# EAGLE design vport (EAGLE 4.16)
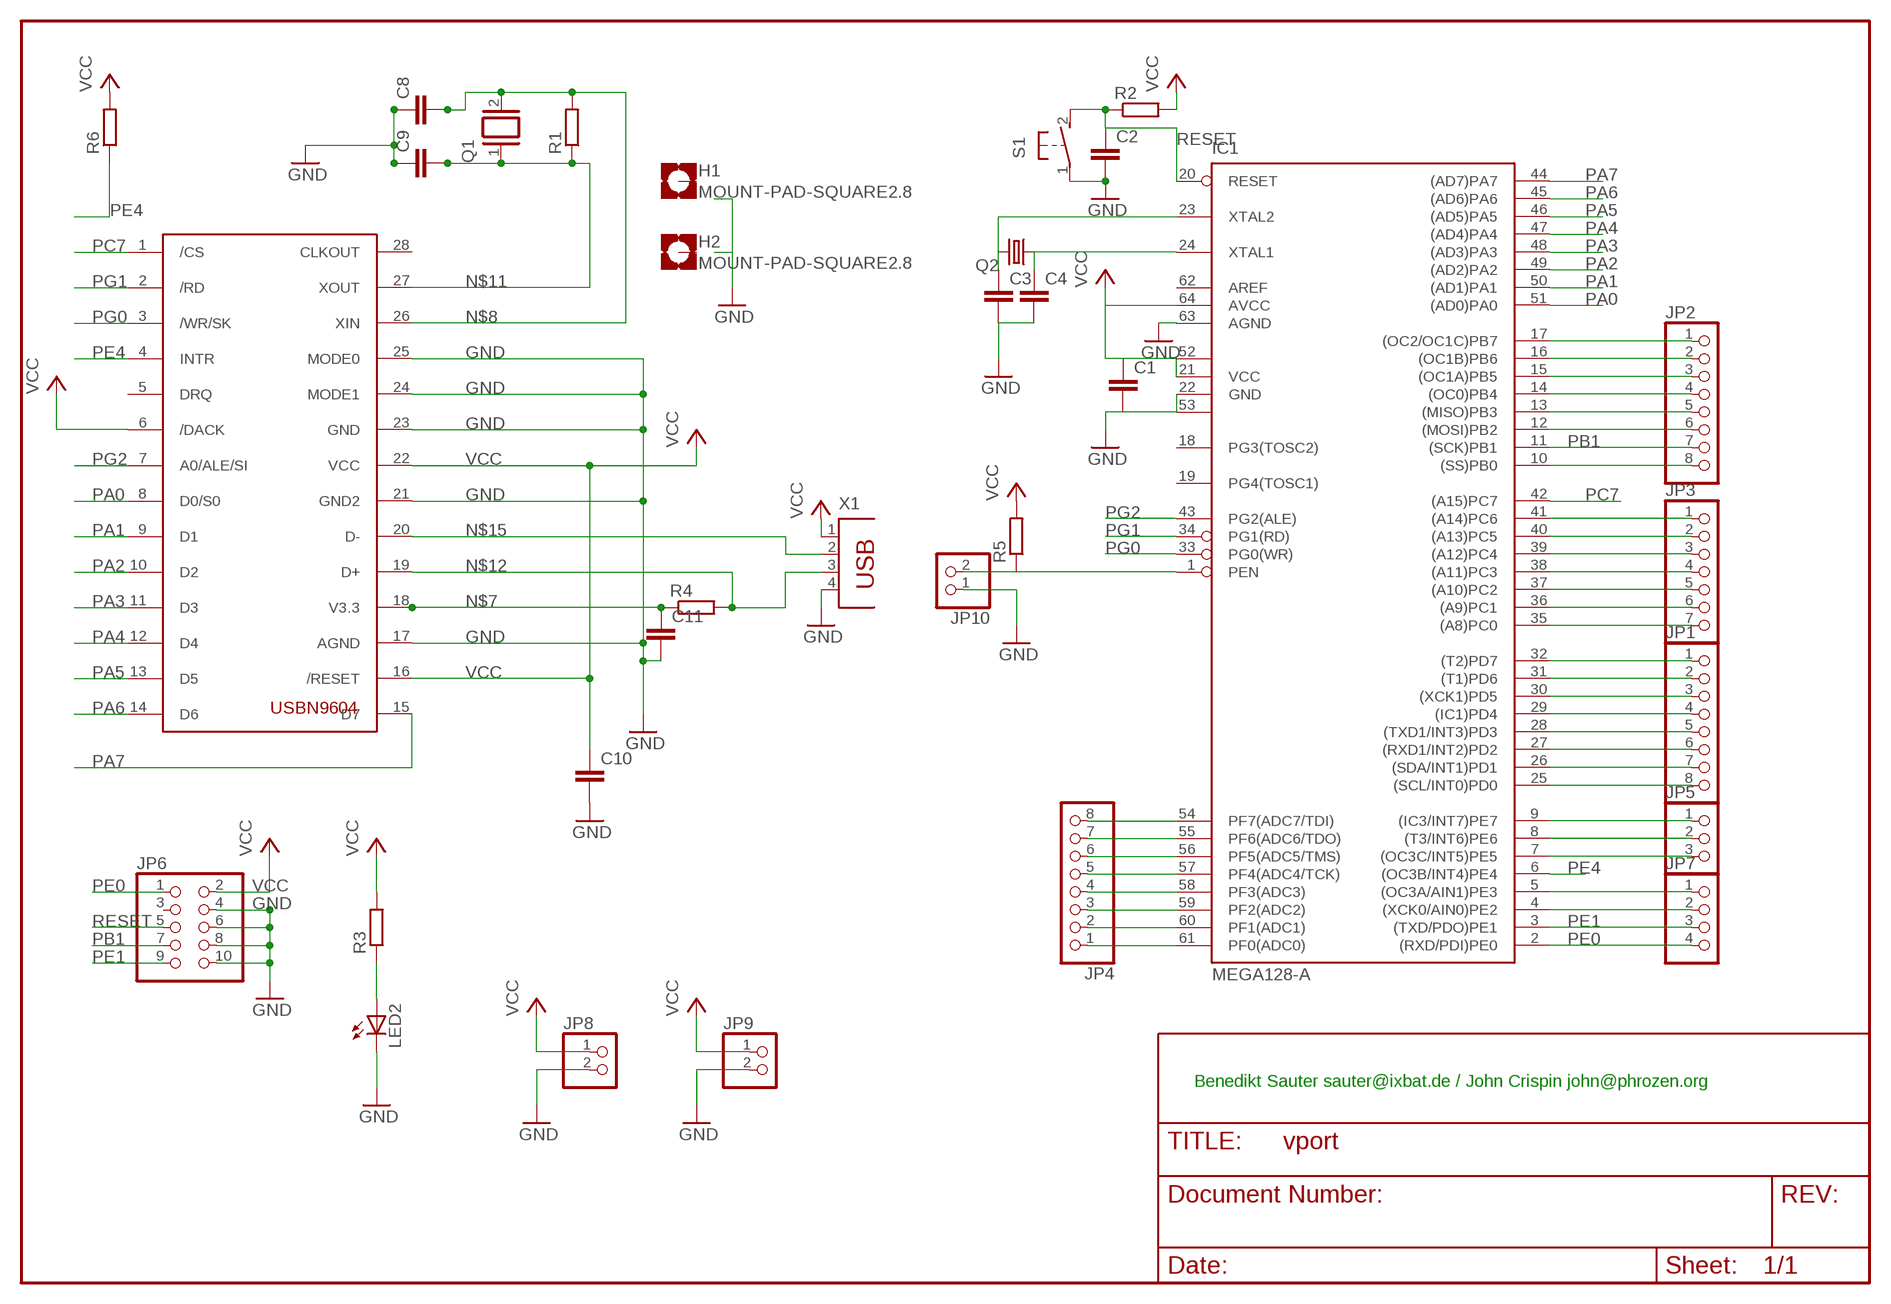
[diagram p0: schematic, sheet 1]

## Parts
C1  C-EUC0805K  [C0805K]
C2  C-EUC0805K  [C0805K]
C3  C-EUC0805K  [C0805K]
C4  C-EUC0805K  [C0805K]
C8  C-EUC0805K  [C0805K]
C9  C-EUC0805K  [C0805K]
C10  C-EUC0805K  [C0805K]
C11  C-EUC0805K  [C0805K]
H1  MOUNT-PAD-SQUARE2.8  [2,8-PAD-SQUARE]
H2  MOUNT-PAD-SQUARE2.8  [2,8-PAD-SQUARE]
IC1  MEGA128-A  [TQFP64]
JP1  PINHD-1X8  [1X08]
JP2  PINHD-1X8  [1X08]
JP3  PINHD-1X7  [1X07]
JP4  PINHD-1X8  [1X08]
JP5  PINHD-1X3  [1X03]
JP6  PINHD-2X5  [2X05]
JP7  PINHD-1X4  [1X04]
JP8  PINHD-1X2  [1X02]
JP9  PINHD-1X2  [1X02]
JP10  PINHD-1X2  [1X02]
LED2  LEDCHIP-LED0805  [CHIP-LED0805]
M1  USBN9604  [SO28-3]
Q1  XTAL/S  [QS]
Q2  CRYSTALHC49S  [HC49/S]
R1  R-EU_R0805  [R0805]
R2  R-EU_R0805  [R0805]
R3  R-EU_M0805  [M0805]
R4  R-EU_R0805  [R0805]
R5  R-EU_R0805  [R0805]
R6  R-EU_R0805  [R0805]
S1  31-XX  [B3F-31XX]
X1  PN61729  [PN61729]

## Nets
GND: C1.2 C2.2 C3.2 C4.2 C8.1 C9.1 C10.2 C11.2 IC1.22(GND) IC1.53(GND1) IC1.63(AGND) JP6.4 JP6.6 JP6.8 JP6.10 JP8.2 JP9.2 JP10.1 LED2.C M1.17(AGND) M1.21(GND2) M1.23(GND) M1.24(MODE1) M1.25(MODE0) S1.1(P) X1.4
N$1: IC1.17((OC2/OC1C)PB7) JP2.1
N$2: IC1.16((OC1B)PB6) JP2.2
N$3: IC1.15((OC1A)PB5) JP2.3
N$4: IC1.1(PEN) JP10.2 R5.1
N$5: C3.1 IC1.23(XTAL2) Q2.2
N$6: C4.1 IC1.24(XTAL1) Q2.1
N$7: C11.1 M1.18(V3.3) R4.1
N$8: C8.2 M1.26(XIN) Q1.2 R1.2
N$9: IC1.14((OC0)PB4) JP2.4
N$10: IC1.13((MISO)PB3) JP2.5
N$11: C9.2 M1.27(XOUT) Q1.1 R1.1
N$12: M1.19(D+) R4.2 X1.3
N$13: LED2.A R3.1
N$14: IC1.12((MOSI)PB2) JP2.6
N$15: M1.20(D-) X1.2
N$17: IC1.10((SS)PB0) JP2.8
N$18: IC1.32((T2)PD7) JP1.1
N$19: IC1.31((T1)PD6) JP1.2
N$20: IC1.30((XCK1)PD5) JP1.3
N$21: IC1.29((IC1)PD4) JP1.4
N$22: IC1.28((TXD1/INT3)PD3) JP1.5
N$23: IC1.27((RXD1/INT2)PD2) JP1.6
N$24: IC1.26((SDA/INT1)PD1) JP1.7
N$25: IC1.25((SCL/INT0)PD0) JP1.8
N$26: IC1.61(PF0(ADC0)) JP4.1
N$27: IC1.60(PF1(ADC1)) JP4.2
N$28: IC1.59(PF2(ADC2)) JP4.3
N$29: IC1.58(PF3(ADC3)) JP4.4
N$30: IC1.57(PF4(ADC4/TCK)) JP4.5
N$31: IC1.56(PF5(ADC5/TMS)) JP4.6
N$32: IC1.55(PF6(ADC6/TDO)) JP4.7
N$33: IC1.54(PF7(ADC7/TDI)) JP4.8
N$34: IC1.41((A14)PC6) JP3.1
N$35: IC1.40((A13)PC5) JP3.2
N$36: IC1.39((A12)PC4) JP3.3
N$37: IC1.38((A11)PC3) JP3.4
N$38: IC1.37((A10)PC2) JP3.5
N$39: IC1.36((A9)PC1) JP3.6
N$40: IC1.35((A8)PC0) JP3.7
N$41: IC1.9((IC3/INT7)PE7) JP5.1
N$42: IC1.8((T3/INT6)PE6) JP5.2
N$43: IC1.7((OC3C/INT5)PE5) JP5.3
N$44: IC1.5((OC3A/AIN1)PE3) JP7.1
N$45: IC1.4((XCK0/AIN0)PE2) JP7.2
PA0: IC1.51((AD0)PA0) M1.8(D0/S0)
PA1: IC1.50((AD1)PA1) M1.9(D1)
PA2: IC1.49((AD2)PA2) M1.10(D2)
PA3: IC1.48((AD3)PA3) M1.11(D3)
PA4: IC1.47((AD4)PA4) M1.12(D4)
PA5: IC1.46((AD5)PA5) M1.13(D5)
PA6: IC1.45((AD6)PA6) M1.14(D6)
PA7: IC1.44((AD7)PA7) M1.15(D7)
PB1: IC1.11((SCK)PB1) JP2.7 JP6.7
PC7: IC1.42((A15)PC7) M1.1(/CS)
PE0: IC1.2((RXD/PDI)PE0) JP6.1 JP7.4
PE1: IC1.3((TXD/PDO)PE1) JP6.9 JP7.3
PE4: IC1.6((OC3B/INT4)PE4) M1.4(INTR) R6.1
PG0: IC1.33(PG0(WR)) M1.3(/WR/SK)
PG1: IC1.34(PG1(RD)) M1.2(/RD)
PG2: IC1.43(PG2(ALE)) M1.7(A0/ALE/SI)
RESET: C2.1 IC1.20(RESET) JP6.5 R2.1 S1.2(S)
VCC: C1.1 C10.1 IC1.21(VCC) IC1.52(VCC1) IC1.64(AVCC) JP6.2 JP8.1 JP9.1 M1.6(/DACK) M1.16(/RESET) M1.22(VCC) R2.2 R3.2 R5.2 R6.2 X1.1
Unconnected: H1.B2,8(MOUNT) H2.B2,8(MOUNT) IC1.18(PG3(TOSC2)) IC1.19(PG4(TOSC1)) IC1.62(AREF) JP6.3 M1.5(DRQ) M1.28(CLKOUT)

## Notes on the sheet
- Benedikt Sauter sauter@ixbat.de / John Crispin john@phrozen.org

## Library data of the parts
C1-C4 C8-C11 = rcl:C-EU: CAPACITOR, European symbol
H1 H2 = holes:MOUNT-PAD-SQUARE: MOUNTING PAD, square
IC1 = atmel:MEGA128: MICROCONTROLLER 128 Kbytes FLASH 4 Kbytes SRAM 4 Kbytes EEPROM DUAL USART 8-channel 10 bit ADC Source: avr.lbr
JP1 JP2 JP4 = pinhead:PINHD-1X8: PIN HEADER
JP3 = pinhead:PINHD-1X7: PIN HEADER
JP5 = pinhead:PINHD-1X3: PIN HEADER
JP6 = pinhead:PINHD-2X5: PIN HEADER
JP7 = pinhead:PINHD-1X4: PIN HEADER
JP8-JP10 = pinhead:PINHD-1X2: PIN HEADER
LED2 = led:LED: LED OSRAM: - CHIPLED LG R971, LG N971, LY N971, LG Q971, LY Q971, LO R971, LY R971 LH N974, LH R974 LS Q976, LO Q976, LY Q976 LO Q996 - Hyper CHIPLED LW Q18S LB Q993, LB Q99A, LB R99A - SideLED LS A670, LO A670, LY A670, LG A670, LP A670 LB A673, LV A673, LT A673, LW A673 LH A674 LY A675 LS A676, LA A676, LO A676, LY A676, LW A676 LS A679, LY A679, LG A679 - Hyper Micro SIDELED® LS Y876, LA Y876, LO Y876, LY Y876 LT Y87S - SmartLED LW L88C, LW L88S LB L89C, LB L89S, LG L890 LS L89K, LO L89K, LY L89K LS L896, LA L896, LO L896, LY L896 - TOPLED LS T670, LO T670, LY T670, LG T670, LP T670 LSG T670, LSP T670, LSY T670, LOP T670, LYG T670 LG T671, LOG T671, LSG T671 LB T673, LV T673, LT T673, LW T673 LH T674 LS T676, LA T676, LO T676, LY T676, LB T676, LH T676, LSB T676, LW T676 LB T67C, LV T67C, LT T67C, LS T67K, LO T67K, LY T67K, LW E67C LS E67B, LA E67B, LO E67B, LY E67B, LB E67C, LV E67C, LT E67C LW T67C LS T679, LY T679, LG T679 LS T770, LO T770, LY T770, LG T770, LP T770 LB T773, LV T773, LT T773, LW T773 LH T774 LS E675, LA E675, LY E675, LS T675 LS T776, LA T776, LO T776, LY T776, LB T776 LHGB T686 LT T68C, LB T68C - Hyper Mini TOPLED® LB M676 - Mini TOPLED Santana® LG M470 LS M47K, LO M47K, LY M47K Source: http://www.osram.convergy.de/
M1 = bene:USBN9604
Q1 = special:XTAL/S: CRYSTAL
Q2 = crystal:CRYSTAL: CRYSTAL
R1-R6 = rcl:R-EU_: RESISTOR, European symbol
S1 = switch-omron:31-XX: OMRON SWITCH
X1 = con-berg:PN61729: BERG USB connector

## Board
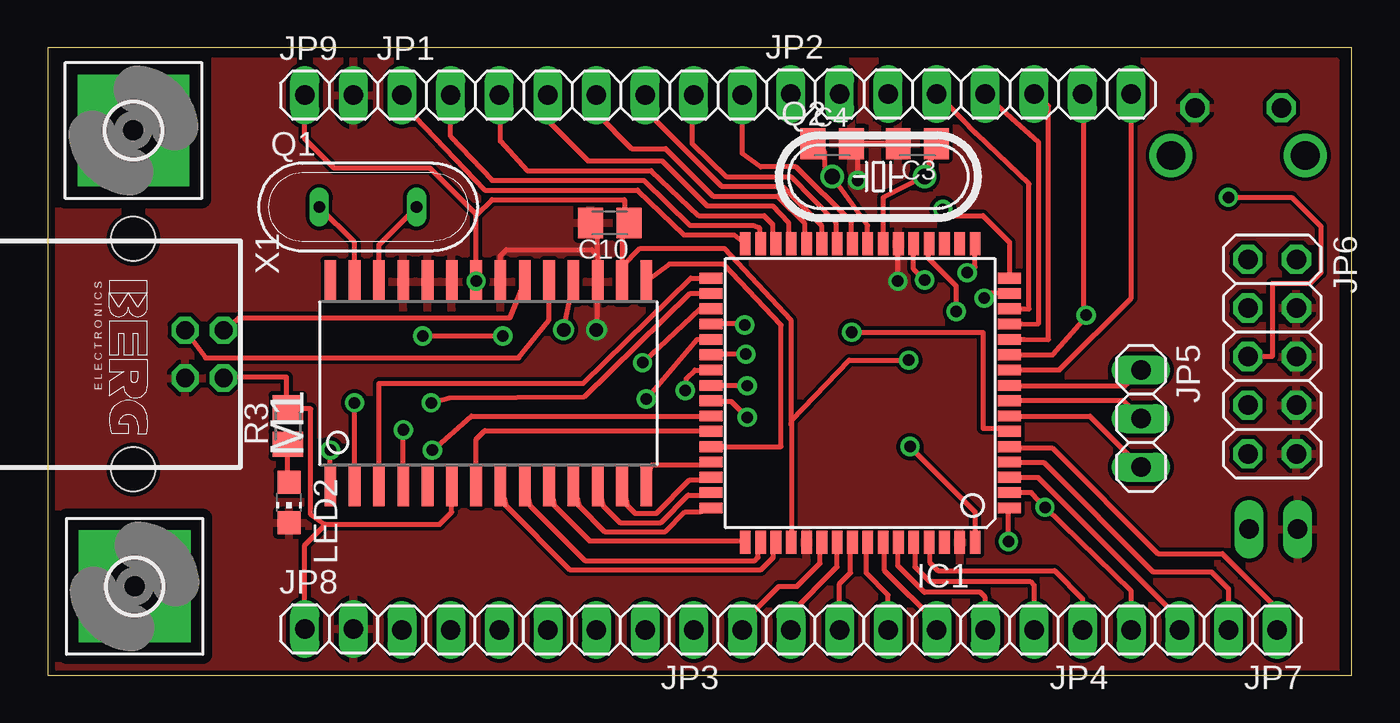
[diagram p1: board, top side]
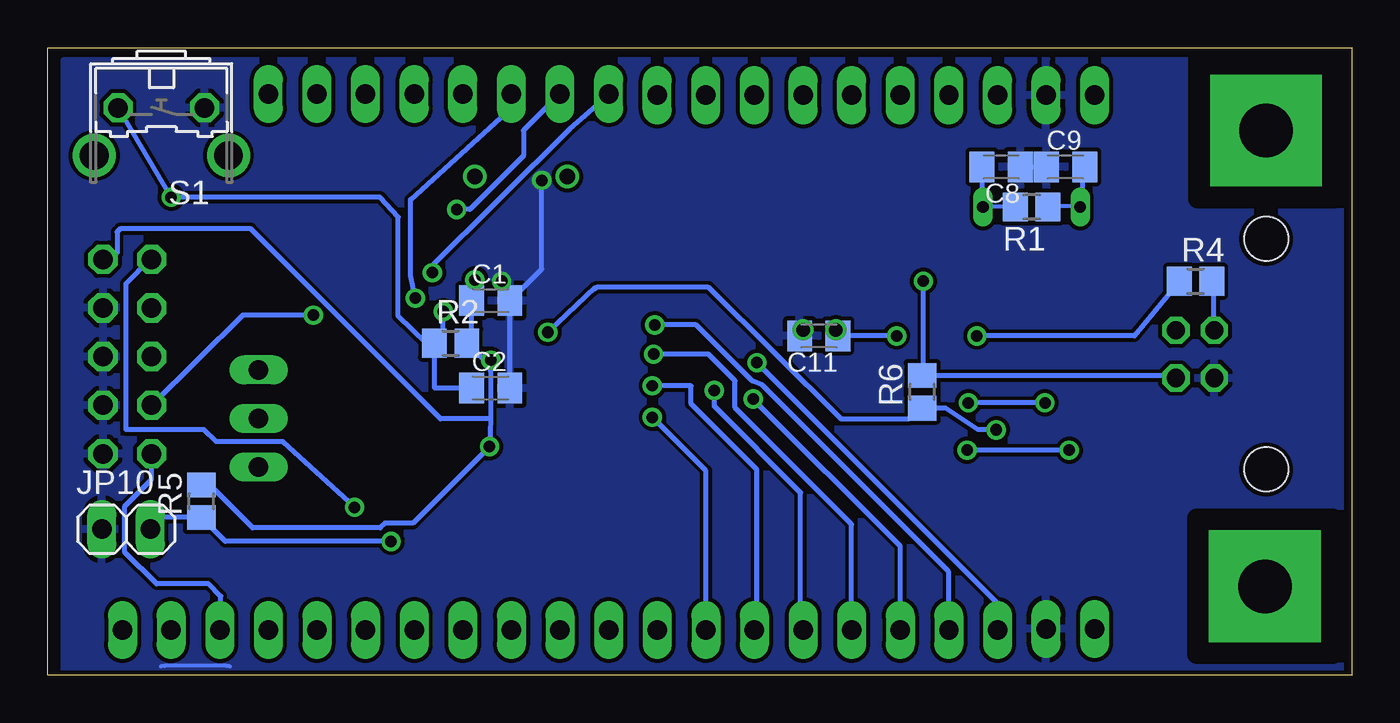
[diagram p2: board, bottom side, seen from below]

Size 68.12 x 32.76 mm. Coordinates in mm from the lower left corner, seen from the top.
Outline: 0,0 68.12,0 68.12,32.76 0,32.76 0,0
Copper layers (1*16): Top 0.035mm / dielectric 1.5mm / Bottom 0.035mm
Design rules "zwilling": minimum track width 8mil, minimum drill 20mil, track to track 8mil, track to pad 8mil, pad to pad 8mil, via to via 8mil, smd to smd 0mil, copper to edge 10mil, drill to drill 10mil, minimum pad ring 8mil, minimum via ring 8mil, stop-mask expansion 4mil, vias tented up to drill 0mil, thermal gap 10mil

### Footprints (pad centres in the part's own frame; a part is rotated, then mirrored left to right if it is on the bottom)
C0805K = smd 1.3 x 1.6: 1 -1,0; 2 1,0
2,8-PAD-SQUARE = drill 2.8 pad 5.842 square: B2,8 0,0
TQFP64 = smd 1.194 x 0.559: 1 -7.8,6; 2 -7.8,5.2; 3 -7.8,4.4; 4 -7.8,3.6; 5 -7.8,2.8; 6 -7.8,2; 7 -7.8,1.2; 8 -7.8,0.4; 9 -7.8,-0.4; 10 -7.8,-1.2; 11 -7.8,-2; 12 -7.8,-2.8; 13 -7.8,-3.6; 14 -7.8,-4.4; 15 -7.8,-5.2; 16 -7.8,-6; 33 7.8,-6; 34 7.8,-5.2; 35 7.8,-4.4; 36 7.8,-3.6; 37 7.8,-2.8; 38 7.8,-2; 39 7.8,-1.2; 40 7.8,-0.4; 41 7.8,0.4; 42 7.8,1.2; 43 7.8,2; 44 7.8,2.8; 45 7.8,3.6; 46 7.8,4.4; 47 7.8,5.2; 48 7.8,6 | smd 0.559 x 1.194: 17 -6,-7.8; 18 -5.2,-7.8; 19 -4.4,-7.8; 20 -3.6,-7.8; 21 -2.8,-7.8; 22 -2,-7.8; 23 -1.2,-7.8; 24 -0.4,-7.8; 25 0.4,-7.8; 26 1.2,-7.8; 27 2,-7.8; 28 2.8,-7.8; 29 3.6,-7.8; 30 4.4,-7.8; 31 5.2,-7.8; 32 6,-7.8; 49 6,7.8; 50 5.2,7.8; 51 4.4,7.8; 52 3.6,7.8; 53 2.8,7.8; 54 2,7.8; 55 1.2,7.8; 56 0.4,7.8; 57 -0.4,7.8; 58 -1.2,7.8; 59 -2,7.8; 60 -2.8,7.8; 61 -3.6,7.8; 62 -4.4,7.8; 63 -5.2,7.8; 64 -6,7.8
1X08 = drill 1.016 long: 1 -8.89,0; 2 -6.35,0; 3 -3.81,0; 4 -1.27,0; 5 1.27,0; 6 3.81,0; 7 6.35,0; 8 8.89,0
1X07 = drill 1.016 long: 1 -7.62,0; 2 -5.08,0; 3 -2.54,0; 4 0,0; 5 2.54,0; 6 5.08,0; 7 7.62,0
1X03 = drill 1.016 long: 1 -2.54,0; 2 0,0; 3 2.54,0
2X05 = drill 1.016 octagon: 1 -5.08,-1.27; 2 -5.08,1.27; 3 -2.54,-1.27; 4 -2.54,1.27; 5 0,-1.27; 6 0,1.27; 7 2.54,-1.27; 8 2.54,1.27; 9 5.08,-1.27; 10 5.08,1.27
1X04 = drill 1.016 long: 1 -3.81,0; 2 -1.27,0; 3 1.27,0; 4 3.81,0
1X02 = drill 1.016 long: 1 -1.27,0; 2 1.27,0
CHIP-LED0805 = smd 1.2 x 1.2: A 0,-1.05; C 0,1.05
SO28-3 = smd 0.61 x 2.21: 1 -8.255,-5.315; 2 -6.985,-5.315; 3 -5.715,-5.315; 4 -4.445,-5.315; 5 -3.175,-5.315; 6 -1.905,-5.315; 7 -0.635,-5.315; 8 0.635,-5.315; 9 1.905,-5.315; 10 3.175,-5.315; 11 4.445,-5.315; 12 5.715,-5.315; 13 6.985,-5.315; 14 8.255,-5.315; 15 8.255,5.315; 16 6.985,5.315; 17 5.715,5.315; 18 4.445,5.315; 19 3.175,5.315; 20 1.905,5.315; 21 0.635,5.315; 22 -0.635,5.315; 23 -1.905,5.315; 24 -3.175,5.315; 25 -4.445,5.315; 26 -5.715,5.315; 27 -6.985,5.315; 28 -8.255,5.315
QS = drill 0.61 long: 1 -2.54,0; 2 2.54,0
HC49/S = drill 0.813 round: 1 -2.413,0; 2 2.413,0
R0805 = smd 1.3 x 1.5: 1 -0.85,0; 2 0.85,0
M0805 = smd 1.3 x 1.6: 1 -0.95,0; 2 0.95,0
B3F-31XX = drill 1.016 octagon: 1 -2.261,-1.245; 2 2.261,-1.245 | drill 1.499 pad 2.159 round: 3 -3.505,1.245; 4 3.505,1.245
PN61729 = drill 0.95 octagon: 1 1.25,4.71; 2 -1.25,4.71; 3 -1.25,2.71; 4 1.25,2.71 | hole 2.3: -6.02,0; 6.02,0

### Placement (x,y rotation side)
C1  44.98,19.55 0 bottom
C2  44.98,14.98 0 bottom
C3  45.43,27.74 180 top
C4  40.98,27.74 0 top
C8  18.31,26.54 180 bottom
C9  14.95,26.54 0 bottom
C10  29.36,23.62 180 top
C11  27.84,17.71 180 bottom
H1  4.47,28.44 0 top
H2  4.53,4.63 0 top
IC1  42.44,14.73 180 top
JP1  27.39,30.28 0 top
JP2  47.71,30.35 0 top
JP3  26.12,2.34 180 top
JP4  45.17,2.34 180 top
JP5  57.11,13.39 270 top
JP6  63.97,16.63 270 top
JP7  60.41,2.34 180 top
JP8  14.69,2.41 0 top
JP9  14.69,30.28 0 top
JP10  64.03,7.62 0 bottom
LED2  12.6,9.01 180 top
M1  23.01,15.23 0 top
Q1  16.73,24.44 0 top
Q2  43.4,26.03 0 top
R1  16.73,24.44 180 bottom
R2  47.08,17.33 0 bottom
R3  12.54,13.01 90 top
R4  8.15,20.57 0 bottom
R5  60.1,9.08 90 bottom
R6  22.44,14.79 90 bottom
S1  62.19,28.38 180 bottom
X1  4.47,16.76 270 top

### Tracks (layer width: path | path; a pad name or v marks a point on that pad's centre or on a via)
GND  (via drill 0.6, 0.7)
  Top 0.254: v28.66,18.03 M1.17 28.73,21.9 | C10.2 28.73,23.25 28.73,21.9 | M1.21 23.65,21.9 23.96,22.22 28.41,22.22 28.73,21.9 | IC1.22 44.41,22.5 v44.41,20.57 | C4.2 C3.2 42.32,27.74 v42.32,25.84
  Bottom 0.203: 62.21,0.46 62.03,0.47 58.78,0.47 58.62,0.46
  Bottom 0.254: C11.2 28.85,17.71 v28.66,18.03 | C1.2 43.98,19.51 43.97,19.49 43.98,19.47 C2.2 | C1.2 44.41,19.98 v44.41,20.57 | C1.2 43.97,19.55 42.32,21.2 v42.32,25.84 | C8.1 C9.1
  pour Top: 0.6,32.06 67.27,32.06 67.27,0.31 0.6,0.31
  pour Bottom: 0.6,32.06 67.27,32.06 67.27,0.31 0.6,0.31
N$1  (via drill 0.6)
  Top 0.254: IC1.17 48.44,21.3 v48.03,21.01
  Bottom 0.254: v48.03,21.01 48.22,21.2 40.86,28.51 38.82,30.28 JP2.1
N$2  (via drill 0.6)
  Top 0.254: IC1.16 50.24,22.61 48.86,24 47.08,24 v46.76,24.32
  Bottom 0.254: v46.76,24.32 46.06,24.32 43.27,27.11 43.27,28.44 JP2.2
N$3  (via drill 0.6)
  Top 0.254: IC1.15 49.1,19.93 v48.92,19.68
  Bottom 0.254: v48.92,19.68 48.92,19.62 49.17,20.89 49.17,24.82 44.16,29.4 44.16,30.22 43.97,30.41 JP2.3
N$4  (via drill 0.6)
  Top 0.254: 50.19,8.78 50.19,8.82 | 50.19,8.78 IC1.1 | v50.19,6.98 50.19,8.78
  Bottom 0.254: JP10.2 62.13,8.25 60.12,8.25 R5.1 58.85,6.98 v50.19,6.98
N$5
  Top 0.254: IC1.23 43.65,24.95 45.75,26.03 Q2.2 46.44,27.74 C3.1
N$6
  Top 0.254: IC1.24 42.83,22.54 42.82,22.54 42.82,23.49 Q2.1 40.6,26.6 | 40.6,26.6 40.6,26.41 | C4.1 40.6,27.32 40.6,26.6
N$7  (via drill 0.6, 0.7)
  Top 0.254: v26.95,18.03 M1.18 | v19.58,17.71 v23.77,17.71
  Bottom 0.254: C11.1 26.82,17.71 v26.95,18.03 | C11.1 26.89,17.71 | R4.1 11.35,17.71 v19.58,17.71 | v23.77,17.71 C11.1
N$8
  Top 0.254: M1.26 17.3,22.47 Q1.2
  Bottom 0.203: R1.2 18.16,24.49 18.79,24.49 Q1.2
  Bottom 0.254: R1.2 17.55,24.44 | C8.2 19.33,26.54 Q1.2
N$9
  Top 0.254: IC1.14 51.03,19.13 51.27,19.11 51.27,25.65 48.54,28.25 48.48,28.32 46.44,30.41 JP2.4
N$10
  Top 0.254: IC1.13 50.87,18.33 51.78,18.35 51.78,27.81 48.92,30.35 JP2.5
N$11
  Top 0.254: M1.27 16.03,22.6 Q1.1
  Bottom 0.203: R1.1 15.3,24.49 14.66,24.49 Q1.1
  Bottom 0.254: Q1.1 C9.2
N$12
  Top 0.254: X1.3 8.24,16.57 24.6,16.57 26.19,18.54 M1.19 26.19,20.57
  Bottom 0.254: 7.2,17.99 7.2,17.97 | X1.3 7.2,17.99 | R4.2 7.2,20.15 7.2,17.99
N$13
  Top 0.254: 12.54,10.06 12.54,10.03 | LED2.A 12.54,10.06 | 12.54,10.06 R3.1
N$14
  Top 0.254: IC1.12 51.02,17.53 52.29,17.52 52.29,29.71 51.52,30.41 JP2.6
N$15
  Top 0.254: M1.20 24.96,20.62 24.16,18.66 9.99,18.66 X1.2
N$17
  Top 0.254: IC1.10 50.25,15.93 52.86,15.93 56.6,19.68 JP2.8 56.6,30.41
N$18
  Top 0.254: IC1.32 35.86,22.98 33.24,22.98 30.82,25.33 22.82,25.33 18.63,29.71 18.63,30.28 JP1.1
N$19
  Top 0.254: IC1.31 37.17,22.6 37.17,23.36 36.86,23.49 33.55,23.49 31.14,25.84 23.2,25.84 21.04,28.13 JP1.2
N$20
  Top 0.254: IC1.30 37.87,22.7 37.87,23.55 37.43,24 34,24 31.52,26.35 25.04,26.35 23.65,27.87 23.65,30.28 JP1.3
N$21
  Top 0.254: IC1.29 38.7,22.67 38.7,23.62 37.87,24.51 34.44,24.51 32.09,26.86 28.22,26.86 26.12,28.95 JP1.4 26.12,30.35
N$22
  Top 0.254: IC1.28 39.52,22.65 39.52,23.62 38.12,25.01 34.76,25.01 32.28,27.49 30.51,27.49 28.66,29.33 JP1.5
N$23
  Top 0.254: IC1.27 40.41,22.56 40.41,23.49 38.38,25.52 35.2,25.52 31.2,29.52 JP1.6
N$24
  Top 0.254: IC1.26 41.17,22.6 41.17,23.62 38.82,26.03 35.46,26.03 33.68,27.74 33.68,30.28 JP1.7
N$25
  Top 0.254: IC1.25 42,22.83 42,23.68 39.08,26.54 37.24,26.54 36.28,27.24 JP1.8
N$26
  Top 0.254: JP4.1 54.06,4 52.6,5.46 46.51,5.46 46.06,5.9 46.06,6.85 46,6.92 46.01,6.93 IC1.61
N$27
  Top 0.254: JP4.2 51.52,4.69 51.33,4.88 46.06,4.88 45.3,5.65 45.3,6.85 IC1.60
N$28
  Top 0.254: JP4.3 48.98,4.06 48.73,4.31 45.81,4.31 44.41,5.71 44.41,6.85 44.44,6.88 IC1.59
N$29
  Top 0.254: JP4.4 46.44,2.73 43.71,5.46 43.71,6.85 IC1.58
N$30
  Top 0.254: JP4.5 43.9,4.19 42.76,5.33 42.76,6.66 42.89,6.79 42.84,6.83 IC1.57
N$31
  Top 0.254: JP4.6 41.36,4.76 41.94,5.33 41.94,6.79 42.06,6.92 IC1.56
N$32
  Top 0.254: JP4.7 38.82,3.23 41.24,5.65 41.24,6.79 41.17,6.85 IC1.55
N$33
  Top 0.254: JP4.8 36.28,2.73 38.19,4.63 39.14,4.63 40.35,5.84 40.35,6.79 40.44,6.88 IC1.54
N$34  (via drill 0.6)
  Top 0.254: IC1.41 34.63,14.28 35.71,14.28 v36.54,13.46
  Bottom 0.254: JP3.1 33.74,10.66 v36.54,13.46
N$35  (via drill 0.6)
  Top 0.254: 34.62,15.11 34.57,15.11 | 34.62,15.11 IC1.40 | v36.54,15.11 34.62,15.11
  Bottom 0.254: v36.54,15.11 34.51,15.11 34.51,14.16 31.08,10.73 31.08,2.28 31.14,2.34 JP3.2
N$36  (via drill 0.6)
  Top 0.254: IC1.39 33.8,15.93 33.36,15.49 33.36,15.11 v33.3,14.85
  Bottom 0.254: v33.3,14.85 33.3,14.03 28.79,9.52 28.79,2.28 28.73,2.22 28.66,2.28 JP3.3
N$37  (via drill 0.6)
  Top 0.254: IC1.38 34.63,16.74 34.63,16.76 v36.48,16.76
  Bottom 0.254: v36.48,16.76 33.62,16.76 32.22,15.36 32.22,13.96 26.12,7.87 JP3.4
N$38  (via drill 0.6)
  Top 0.254: IC1.37 33.94,17.53 v31.27,14.41
  Bottom 0.254: 23.58,2.22 JP3.5 23.58,6.73 v31.27,14.41
N$39  (via drill 0.6)
  Top 0.254: IC1.36 34.66,18.35 36.35,18.35 v36.41,18.28
  Bottom 0.254: v36.41,18.28 34.25,18.28 31.33,15.36 30.82,15.17 21.04,5.39 JP3.6 21.04,2.28
N$40  (via drill 0.6)
  Top 0.254: IC1.35 34.08,19.13 v31.08,16.31
  Bottom 0.254: JP3.7 18.5,3.74 v31.08,16.31
N$41
  Top 0.254: JP5.1 56.29,15.11 50.25,15.11 IC1.9
N$42
  Top 0.254: IC1.8 50.26,14.35 56.16,14.35 JP5.2
N$43
  Top 0.254: IC1.7 54.45,13.52 JP5.3
N$44
  Top 0.254: JP7.1 64.22,3.49 61.37,6.34 58,6.34 52.48,11.87 50,11.87 50.06,11.93 IC1.5
N$45
  Top 0.254: JP7.2 61.68,4.5 60.8,5.39 57.75,5.39 52.03,11.11 50.25,11.11 IC1.4
PA0
  Top 0.254: IC1.51 37.9,6.38 37.9,6.14 37.27,5.5 27.27,5.5 23.93,8.84 M1.8
PA1
  Top 0.254: IC1.50 37.11,6.38 37.11,6.14 36.95,5.98 28.06,5.98 25.2,8.84 M1.9
PA2
  Top 0.254: IC1.49 36.24,7.01 28.3,7.01 26.47,8.84 M1.10
PA3
  Top 0.254: IC1.48 34.09,8.52 33.3,8.52 32.27,7.49 29.09,7.49 27.74,8.84 M1.11
PA4
  Top 0.254: IC1.47 34.09,9.39 33.46,9.39 32.03,7.96 29.89,7.96 29.01,8.84 M1.12
PA5
  Top 0.254: IC1.46 34.09,10.19 33.54,10.19 31.79,8.44 30.68,8.44 30.28,8.84 M1.13
PA6
  Top 0.254: IC1.45 34.09,10.98 31.55,10.98 M1.14
PA7
  Top 0.254: IC1.44 35.33,11.93 38.32,11.93 38.32,18.28 35.33,21.46 32.47,21.46 31.27,20.57 M1.15
PB1  (via drill 0.6)
  Top 0.254: IC1.11 52.51,16.73 54.29,18.75 | 54.29,18.75 54.13,18.92 54.13,29.33 54.06,30.28 JP2.7 | 54.29,18.75 54.12,18.85 v54.25,18.79
  Bottom 0.254: JP6.7 57.94,18.79 v54.25,18.79
PC7  (via drill 0.6)
  Top 0.254: v20.09,11.74 22.12,13.52 IC1.42 | M1.1 v14.76,11.74
  Bottom 0.254: v14.76,11.74 v20.09,11.74
PE0  (via drill 0.6)
  Top 0.254: JP7.4 56.6,4.38 v52.1,8.76 51.4,9.52 50.25,9.52 IC1.2
  Bottom 0.254: JP6.1 62.76,21.71 64.03,20.44 64.03,12.82 59.97,12.82 59.34,12.19 55.84,12.19 v52.1,8.76
PE1
  Top 0.254: IC1.3 51.73,10.33 58.89,3.17 58.89,2.54 59.08,2.34 JP7.3
  Bottom 0.254: JP6.9 62.7,10.22 64.1,8.82 64.1,6.41 62.45,4.76 59.72,4.76 59.08,4.12 59.08,2.34 JP7.3
PE4  (via drill 0.61)
  Top 0.254: v42,17.9 48.86,17.9 48.86,12.89 49.65,12.89 IC1.6 | 18.57,12.76 v18.57,12.81 M1.4
  Bottom 0.254: v18.57,12.81 19.52,12.82 21.21,13.94 R6.1 23.14,13.36 26.66,13.36 33.62,20.25 39.46,20.25 39.54,20.17 39.54,20.22 v42,17.9
PG0
  Top 0.254: IC1.33 33.59,20.73 27.96,15.23 17.3,15.23 M1.3
PG1  (via drill 0.6)
  Top 0.254: M1.2 v16.03,14.22 | v20.03,14.22 20.98,14.47 28.03,14.54 33.55,19.93 34.65,19.93 | 34.65,19.93 34.7,19.93 | 34.65,19.93 IC1.34
  Bottom 0.254: v16.03,14.22 v20.03,14.22
PG2
  Top 0.254: M1.7 22.38,12.31 22.82,12.76 34.63,12.76 34.64,12.75 IC1.43
RESET  (via drill 0.6)
  Top 0.254: v47.46,18.98 47.46,20.32 46,21.78 46,22.48 IC1.20 | JP6.5 63.97,16.63 63.97,20.44 65.94,20.44 66.51,21.01 66.51,23.43 64.99,24.95 v61.68,24.95
  Bottom 0.254: C2.1 47.91,14.98 47.91,17.33 | v47.46,18.98 47.46,17.8 R2.1 47.91,17.33 | S1.2 v61.68,24.95 50.76,24.95 49.81,23.93 49.81,18.73 48.35,17.33 47.91,17.33
VCC  (via drill 0.6)
  Top 0.254: 30.32,23.62 30,23.3 M1.16 30,21.33 30.95,22.28 35.33,22.28 38.82,18.54 38.82,13.08 38.84,13.31 38.84,13.29 | X1.1 9.22,15.55 12.47,15.55 12.47,13.96 R3.2 12.47,13.96 12.41,13.9 13.74,13.9 13.74,8.38 14.44,7.87 14.5,7.87 | M1.22 22.38,20.51 | v22.38,20.57 M1.22 | M1.22 22.38,24 22.41,24.03 | 22.41,24.03 23.2,24.82 30.12,24.82 30.12,23.81 30.32,23.62 | 30.32,23.62 C10.1 | IC1.64 48.44,8.54 v45.05,11.93 | 38.84,13.29 IC1.52 | 38.84,13.29 41.87,16.44 v44.98,16.44 | IC1.21 45.24,21.2 v45.81,20.63 | M1.6 21.11,8.5 20.47,7.87 14.5,7.87 | JP9.1 13.42,28 14.95,26.47 19.96,26.47 22.41,24.03 | 22.41,24.03 | JP8.1 13.42,6.79 14.5,7.87
  Bottom 0.254: X1.1 X1.1 arc90 9.23,15.55 arc-90 9.32,15.64 R6.2 22.38,15.7 v22.38,20.57 | 44.98,15.87 44.98,13.38 | 44.98,13.38 v45.05,11.93 49.05,7.93 50.51,7.93 50.76,7.68 57.43,7.68 59.68,9.93 R5.2 | 44.98,15.87 45.05,16.19 46.19,17.33 R2.2 46.25,17.33 45.98,17.6 C1.1 45.98,20.46 v45.81,20.63 | v44.98,16.44 44.98,15.87 | 47.6,13.38 57.53,23.3 64.35,23.3 64.51,23.14 64.51,22.03 JP6.2 | 44.98,13.38 47.6,13.38 | 47.6,13.38 47.59,13.39 | 47.6,13.38